# Altium schematic sheet ASH067476_智信同德_原理图源文件.SchDoc
size A3
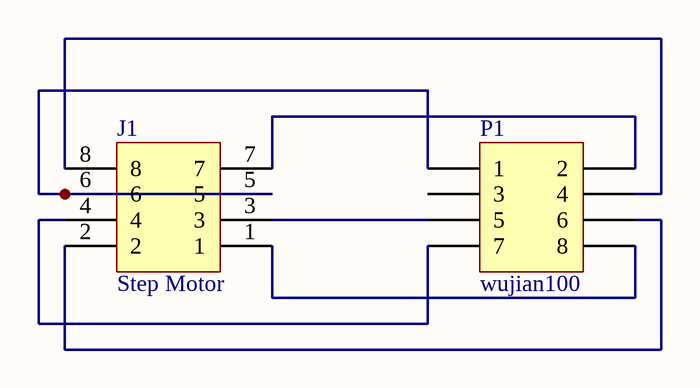
[diagram p0: ASH067476_智信同德_原理图源文件.SchDoc]

## Parts
J1  Pin HDR2X4  [Pin HDR2X4/2.54mm-S]  (value not drawn)
P1  MHDR2X4  [MHDR2X4]  (value not drawn)

## Nets
NetJ1_1: J1.1 P1.8
NetJ1_2: J1.2 P1.6
NetJ1_3: J1.3 P1.5
NetJ1_4: J1.4 P1.7
NetJ1_5: J1.5 J1.6 P1.1
NetJ1_7: J1.7 P1.2
NetJ1_8: J1.8 P1.4

Not connected (* = marked no-connect by the designer): P1 3

## Notes on the sheet
- (near J1) Step Motor
- (near P1) wujian100

## Library data of the parts
P1 = MHDR2X4: Header, 4-Pin, Dual row; LatestRevisionDate: 17-Jul-2002; LatestRevisionNote: Re-released for DXP Platform.; Publisher: Altium Limited